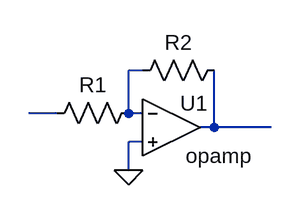
[diagram p0: schematic uninvAmp.asc]
uninvAmp.asc, the LTspice schematic file:
Version 4
SHEET 1 880 680
WIRE 160 48 144 48
WIRE 64 96 32 96
WIRE 144 96 144 48
WIRE 160 96 144 96
WIRE 240 112 240 48
WIRE 240 112 224 112
WIRE 304 112 240 112
WIRE 160 128 144 128
WIRE 144 160 144 128
FLAG 144 160 0
SYMBOL Opamps\\opamp 192 48 R0
WINDOW 0 10 37 Left 2
SYMATTR InstName U1
SYMBOL res 160 80 R90
WINDOW 0 0 56 VBottom 2
WINDOW 3 -52 239 VTop 2
SYMATTR InstName R1
SYMATTR Value ""
SYMBOL res 256 32 R90
WINDOW 0 0 56 VBottom 2
WINDOW 3 -26 21 VTop 2
SYMATTR InstName R2
SYMATTR Value ""

The netlist it stands for:
* uninvAmp.asc
XU1 N001 0 N003 opamp Aol=100K GBW=10Meg  ; pins invin noninvin out
R1 N001 N002
R2 N003 N001
.backanno
.end